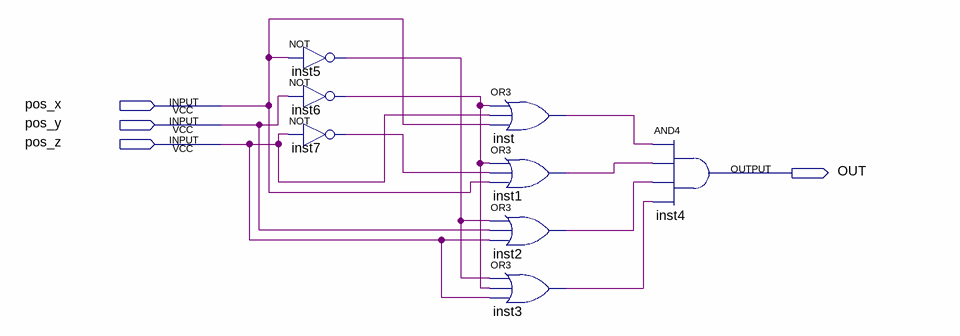
[diagram p0: schematic sheet]
// Quartus schematic week3p_pos_block.bdf as structural Verilog: 8 symbols, 4 pins
module week3p_pos_block (
  input  pos_x,
  input  pos_y,
  input  pos_z,
  output OUT
);

  wire inst1_out, inst2_out, inst3_out, inst5_out, inst6_out, inst7_out, inst_out;

  not inst5 (inst5_out, pos_x);
  not inst6 (inst6_out, pos_y);
  not inst7 (inst7_out, pos_z);
  or inst (inst_out, inst6_out, pos_z, pos_x);
  or inst1 (inst1_out, inst6_out, inst7_out, pos_x);
  or inst2 (inst2_out, inst5_out, pos_y, pos_z);
  or inst3 (inst3_out, inst5_out, inst6_out, pos_z);
  and inst4 (OUT, inst_out, inst1_out, inst2_out, inst3_out);
endmodule
